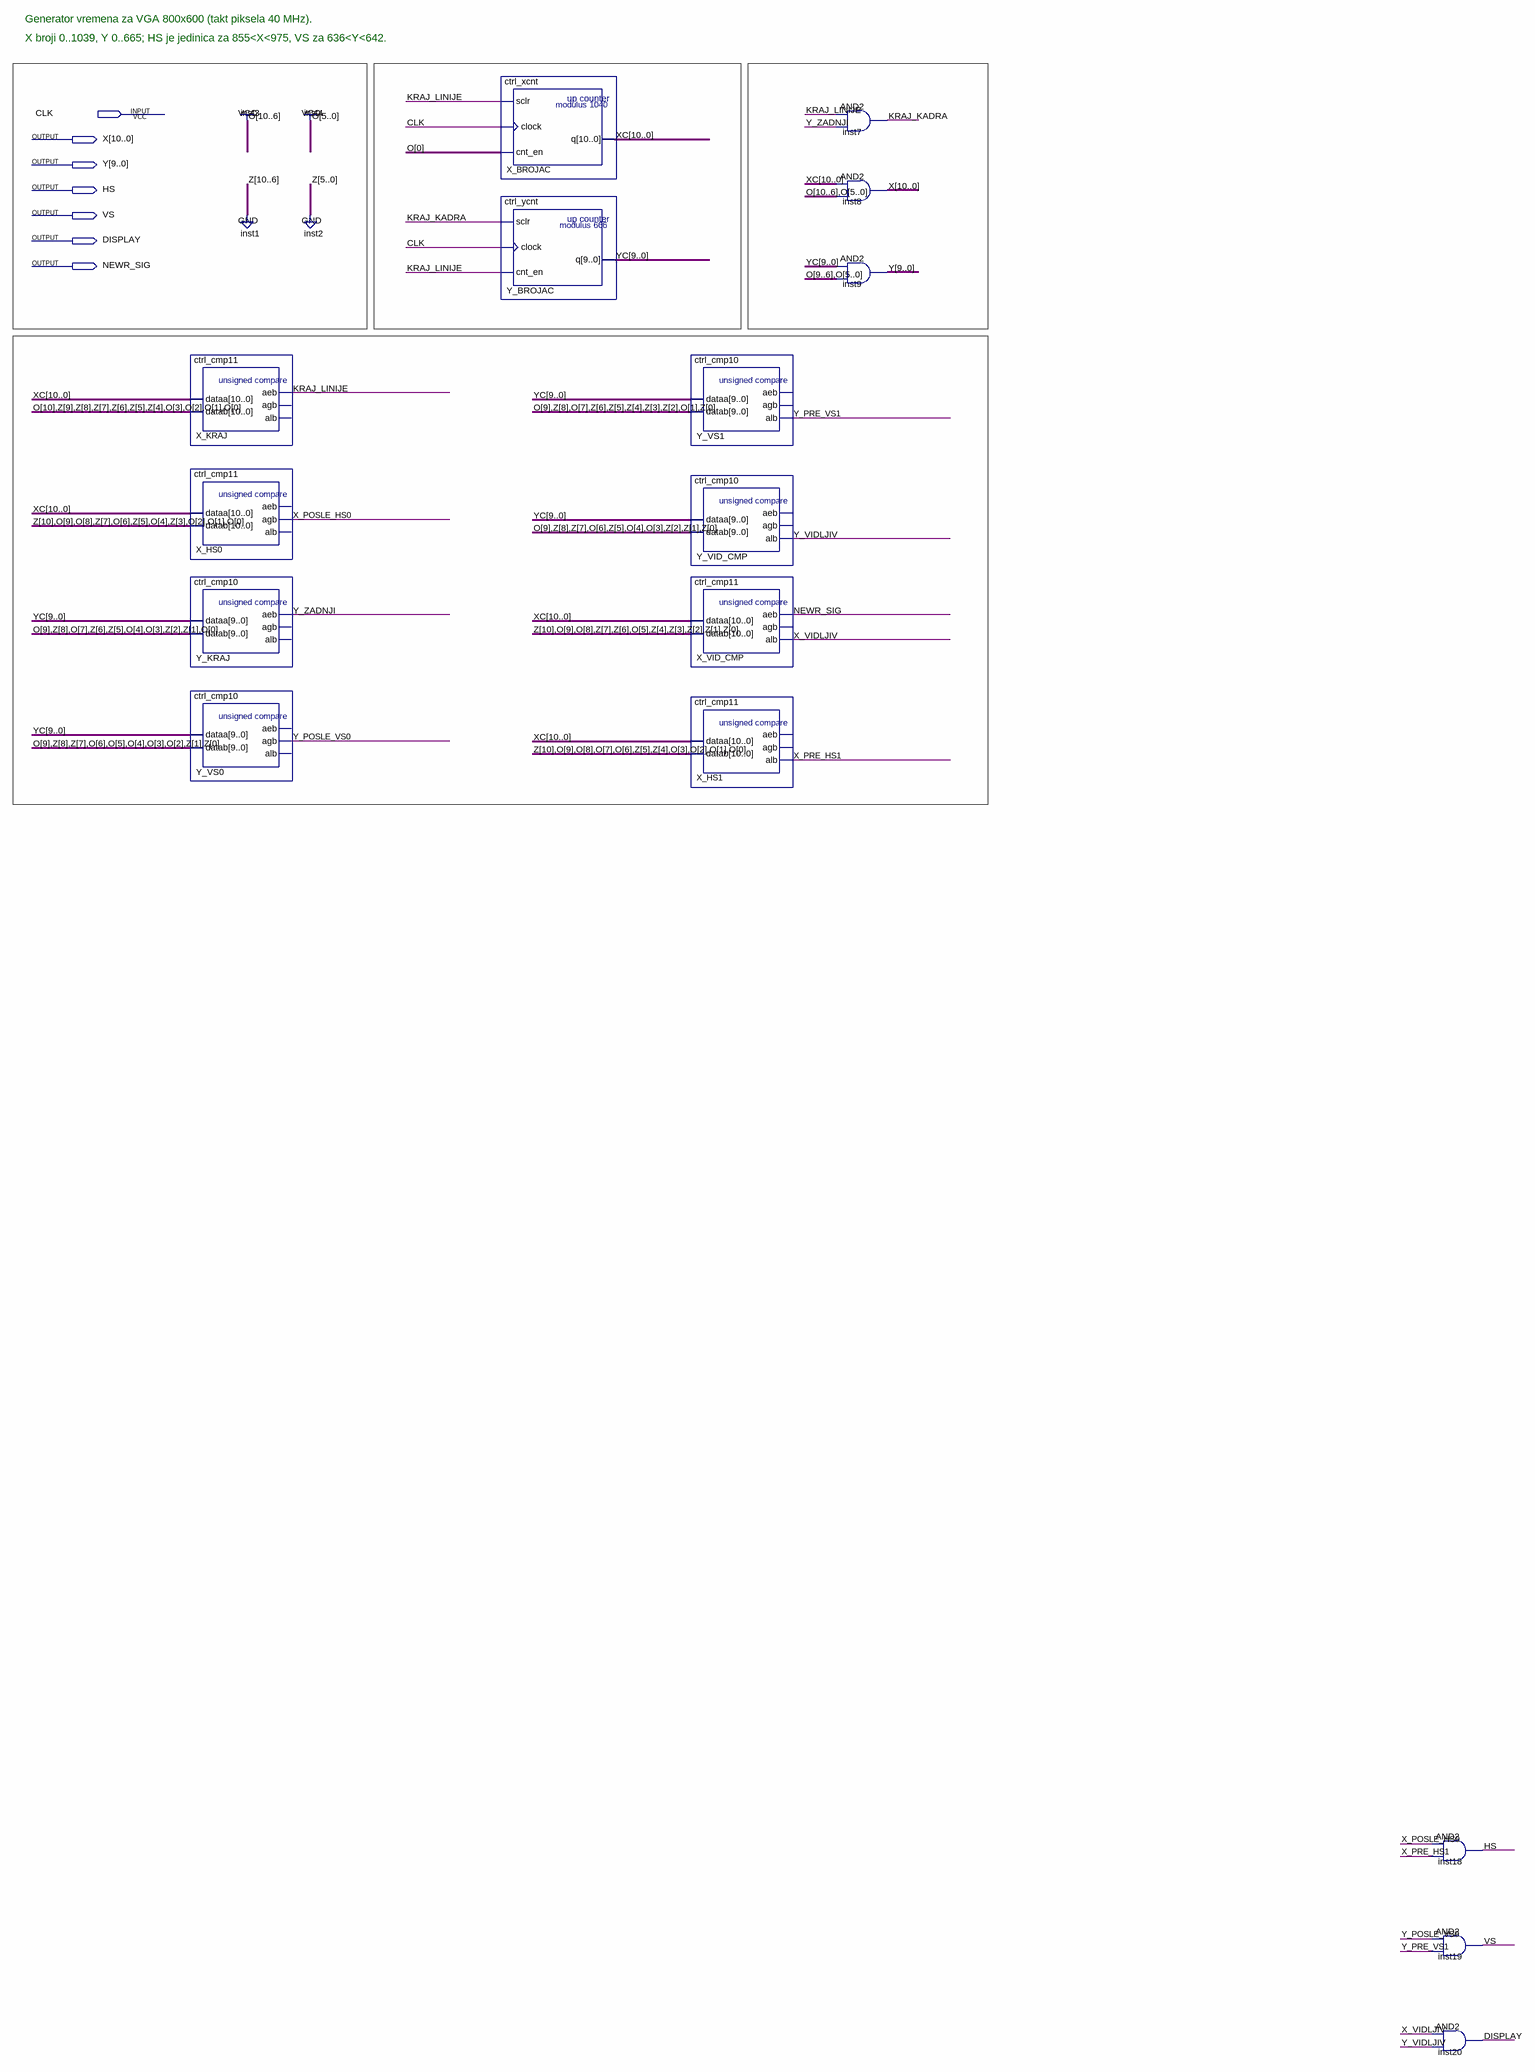
[diagram p0: schematic sheet]
// Quartus schematic Controller.bdf as structural Verilog: 16 symbols, 7 pins
module Controller (
  input  CLK,
  output [10:0] X,
  output [9:0] Y,
  output HS,
  output VS,
  output DISPLAY,
  output NEWR_SIG
);

  wire KRAJ_KADRA, KRAJ_LINIJE, X_POSLE_HS0, X_PRE_HS1, X_VIDLJIV, Y_POSLE_VS0, Y_PRE_VS1, Y_VIDLJIV,
       Y_ZADNJI;
  wire [9:0] YC;
  wire [10:0] XC;

  ctrl_cmp11 X_KRAJ (.dataa(XC), .datab(11'b10000001111), .aeb(KRAJ_LINIJE));  // open: agb, alb
  ctrl_cmp11 X_HS0 (.dataa(XC), .datab(11'b01101010111), .agb(X_POSLE_HS0));  // open: aeb, alb
  ctrl_cmp10 Y_KRAJ (.dataa(YC), .datab(10'b1010011001), .aeb(Y_ZADNJI));  // open: agb, alb
  ctrl_cmp10 Y_VS0 (.dataa(YC), .datab(10'b1001111100), .agb(Y_POSLE_VS0));  // open: aeb, alb
  ctrl_xcnt X_BROJAC (.sclr(KRAJ_LINIJE), .clock(CLK), .cnt_en(1'b1), .q(XC));
  ctrl_ycnt Y_BROJAC (.sclr(KRAJ_KADRA), .clock(CLK), .cnt_en(KRAJ_LINIJE), .q(YC));
  ctrl_cmp10 Y_VS1 (.dataa(YC), .datab(10'b1010000010), .alb(Y_PRE_VS1));  // open: aeb, agb
  ctrl_cmp10 Y_VID_CMP (.dataa(YC), .datab(10'b1001011000), .alb(Y_VIDLJIV));  // open: aeb, agb
  ctrl_cmp11 X_VID_CMP (.dataa(XC), .datab(11'b01100100000), .aeb(NEWR_SIG), .alb(X_VIDLJIV));  // open: agb
  ctrl_cmp11 X_HS1 (.dataa(XC), .datab(11'b01111001111), .alb(X_PRE_HS1));  // open: aeb, agb
  and inst7 (KRAJ_KADRA, KRAJ_LINIJE, Y_ZADNJI);
  assign X = XC & {11{1'b1}};  // AND2 inst8, 11 bits wide
  assign Y = YC & {10{1'b1}};  // AND2 inst9, 10 bits wide
  and inst18 (HS, X_POSLE_HS0, X_PRE_HS1);
  and inst19 (VS, Y_POSLE_VS0, Y_PRE_VS1);
  and inst20 (DISPLAY, X_VIDLJIV, Y_VIDLJIV);

  // Notes on the sheet:
  //   Generator vremena za VGA 800x600 (takt piksela 40 MHz).
  //   X broji 0..1039, Y 0..665; HS je jedinica za 855<X<975, VS za 636<Y<642.
endmodule
